# EAGLE design Main Board v1 (EAGLE 9.6.2)

## Sheet 1 of 2: High Power
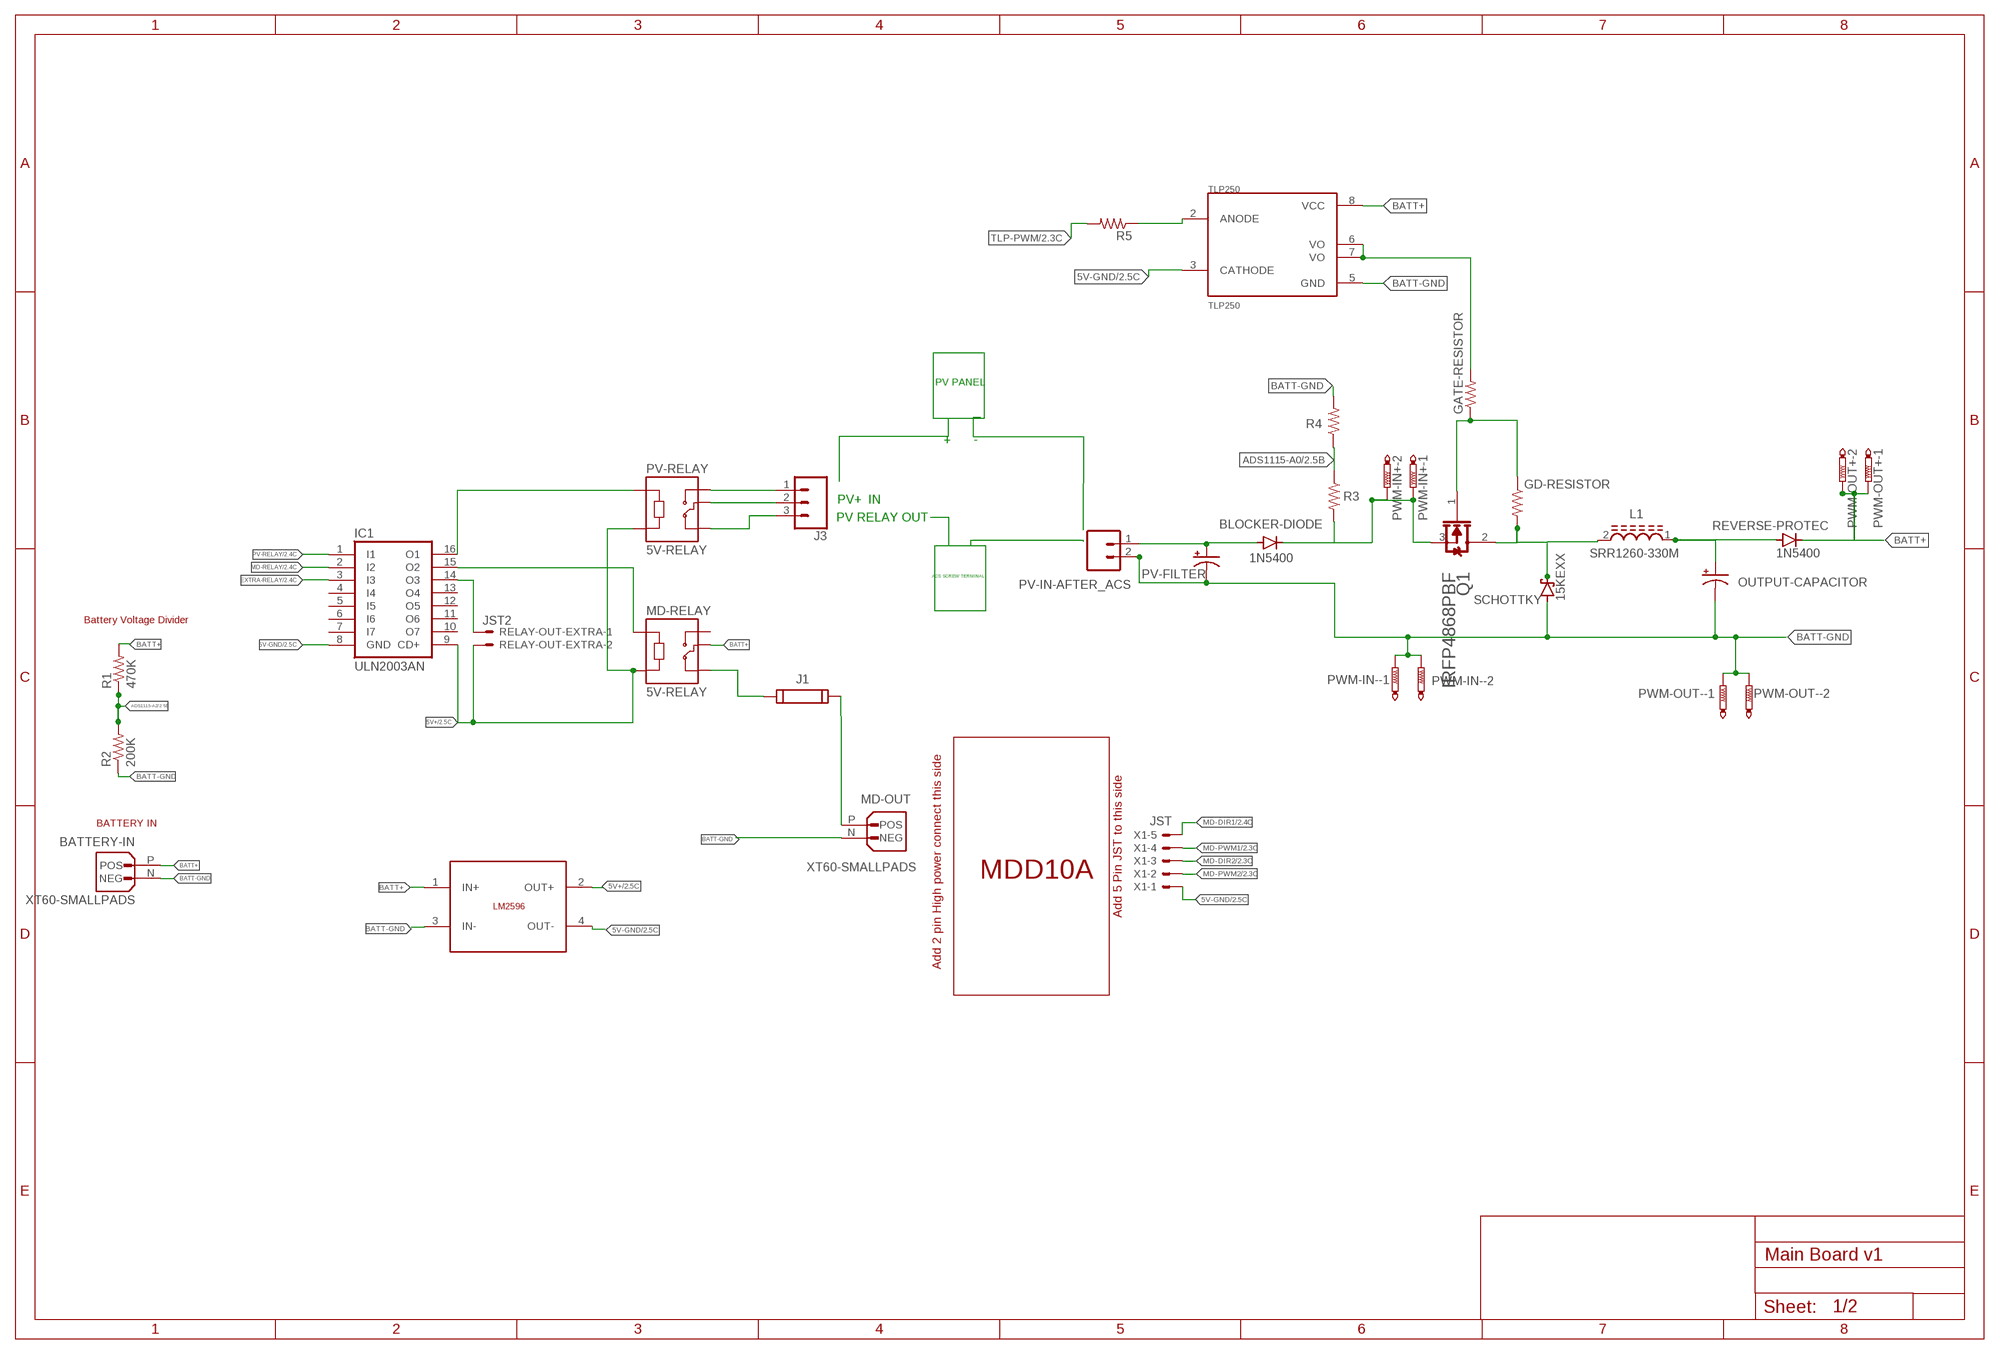
[diagram p0: schematic, sheet 1]

### Parts
BATTERY-IN  XT60-SMALLPADS  [XT-60-SMALLPADS]
BLOCKER-DIODE  1N5400  [DO201-15]
GATE-RESISTOR  R-US_0309/12  [0309/12]
GD-RESISTOR  R-US_0309/12  [0309/12]
IC1  ULN2003AN  [DIL16]
J1  696101000002  [696101000002]
J3  CONN_03SCREW_LOCK  [SCREWTERMINAL-3.5MM-3_LOCK.007S]
L1  SRR1260-330M  [INDP125125X600N]
MD-OUT  XT60-SMALLPADS  [XT-60-SMALLPADS]
MD-RELAY  5V-RELAY  [RELAY-SRD-05VDC-SL-C]
OUTPUT-CAPACITOR  1000UF-RADIAL-5MM-25V-20%-NO-SILK  [CPOL-RADIAL-5MM-10MM-NS]
PV-FILTER  1000UF-RADIAL-5MM-25V-20%-NO-SILK  [CPOL-RADIAL-5MM-10MM-NS]
PV-IN-AFTER_ACS  CONN_023.5MM  [SCREWTERMINAL-3.5MM-2]
PV-RELAY  5V-RELAY  [RELAY-SRD-05VDC-SL-C]
PWM-IN+  PTR2  [P2-38-17]
PWM-IN-  PTR2  [P2-38-17]
PWM-OUT+  PTR2  [P2-38-17]
PWM-OUT-  PTR2  [P2-38-17]
Q1  INFINEON_IRFP4868PBFINFINEON_IRFP4868PBF_0_0  [INFINEON_IRFP4868PBF_0]
R1  470K  R-US_0309/12  [0309/12]
R2  200K  R-US_0309/12  [0309/12]
R3  R-US_0309/12  [0309/12]
R4  R-US_0309/12  [0309/12]
R5  R-US_0309/12  [0309/12]
RELAY-OUT-EXTRA  JST2  JST-XH-02-PIN-LONG-PAD  [JST-XH-02-PACKAGE-LONG-PAD]
REVERSE-PROTEC  1N5400  [DO201-15]
SCHOTTKY  15KEXX  [CB429-17]
TLP250  TLP250  [DIP8]
U$2  MDD10A-MODULE  [MDD10A]
U$5  LM2596-MODULE  [LM2596-MODULE]
X1  JST  JST-XH-05-PIN-LONG-PAD  [JST-XH-05-PACKAGE-LONG-PAD]

### Nets
5V+: IC1.9(CD+) MD-RELAY.A2 PV-RELAY.A2 RELAY-OUT-EXTRA.2 U$5.2(OUT+) ; also sheet 2
5V-GND: IC1.8(GND) TLP250.3(CATHODE) U$5.4(OUT-) X1.1 ; also sheet 2
ADS1115-A0: R3.1 R4.1 ; also sheet 2
ADS1115-A2: R1.1 R2.2 ; also sheet 2
BATT+: BATTERY-IN.P(POS) MD-RELAY.COM PWM-OUT+.TP-1 PWM-OUT+.TP-2 R1.2 REVERSE-PROTEC.C TLP250.8(VCC) U$5.1(IN+)
BATT-GND: BATTERY-IN.N(NEG) MD-OUT.N(NEG) OUTPUT-CAPACITOR.- PV-FILTER.- PV-IN-AFTER_ACS.2 PWM-IN-.TP-1 PWM-IN-.TP-2 PWM-OUT-.TP-1 PWM-OUT-.TP-2 R2.1 R4.2 SCHOTTKY.A TLP250.5(GND) U$5.3(IN-)
EXTRA-RELAY: IC1.3(I3) ; also sheet 2
MD-DIR1: X1.5 ; also sheet 2
MD-DIR2: X1.3 ; also sheet 2
MD-PWM1: X1.4 ; also sheet 2
MD-PWM2: X1.2 ; also sheet 2
MD-RELAY: IC1.2(I2) ; also sheet 2
N$1: J1.2 MD-OUT.P(POS)
N$2: IC1.14(O3) RELAY-OUT-EXTRA.1
N$3: J3.1 PV-RELAY.NO
N$4: J3.2 PV-RELAY.COM
N$5: J1.1 MD-RELAY.NC
N$6: L1.1 OUTPUT-CAPACITOR.+ REVERSE-PROTEC.A
N$23: J3.3 PV-RELAY.NC
N$63: IC1.16(O1) PV-RELAY.A1
N$85: IC1.15(O2) MD-RELAY.A1
N$88: GD-RESISTOR.2 L1.2 Q1.2(D) SCHOTTKY.C
N$92: R5.1 TLP250.2(ANODE)
N$93: BLOCKER-DIODE.A PV-FILTER.+ PV-IN-AFTER_ACS.1
N$95: GATE-RESISTOR.2 TLP250.6(VO) TLP250.7(VO)
N$98: BLOCKER-DIODE.C PWM-IN+.TP-1 PWM-IN+.TP-2 Q1.3(S) R3.2
N$99: GATE-RESISTOR.1 GD-RESISTOR.1 Q1.1(G)
PV-RELAY: IC1.1(I1) ; also sheet 2
TLP-PWM: R5.2 ; also sheet 2
Unconnected: IC1.4(I4) IC1.5(I5) IC1.6(I6) IC1.7(I7) IC1.10(O7) IC1.11(O6) IC1.12(O5) IC1.13(O4) MD-RELAY.NO

### Notes on the sheet
- PV PANEL
- + | -
- PV+  IN
- PV RELAY OUT
- ACS SCREW TERMINAL
- Battery Voltage Divider
- BATTERY IN

## Sheet 2 of 2: Embedded System
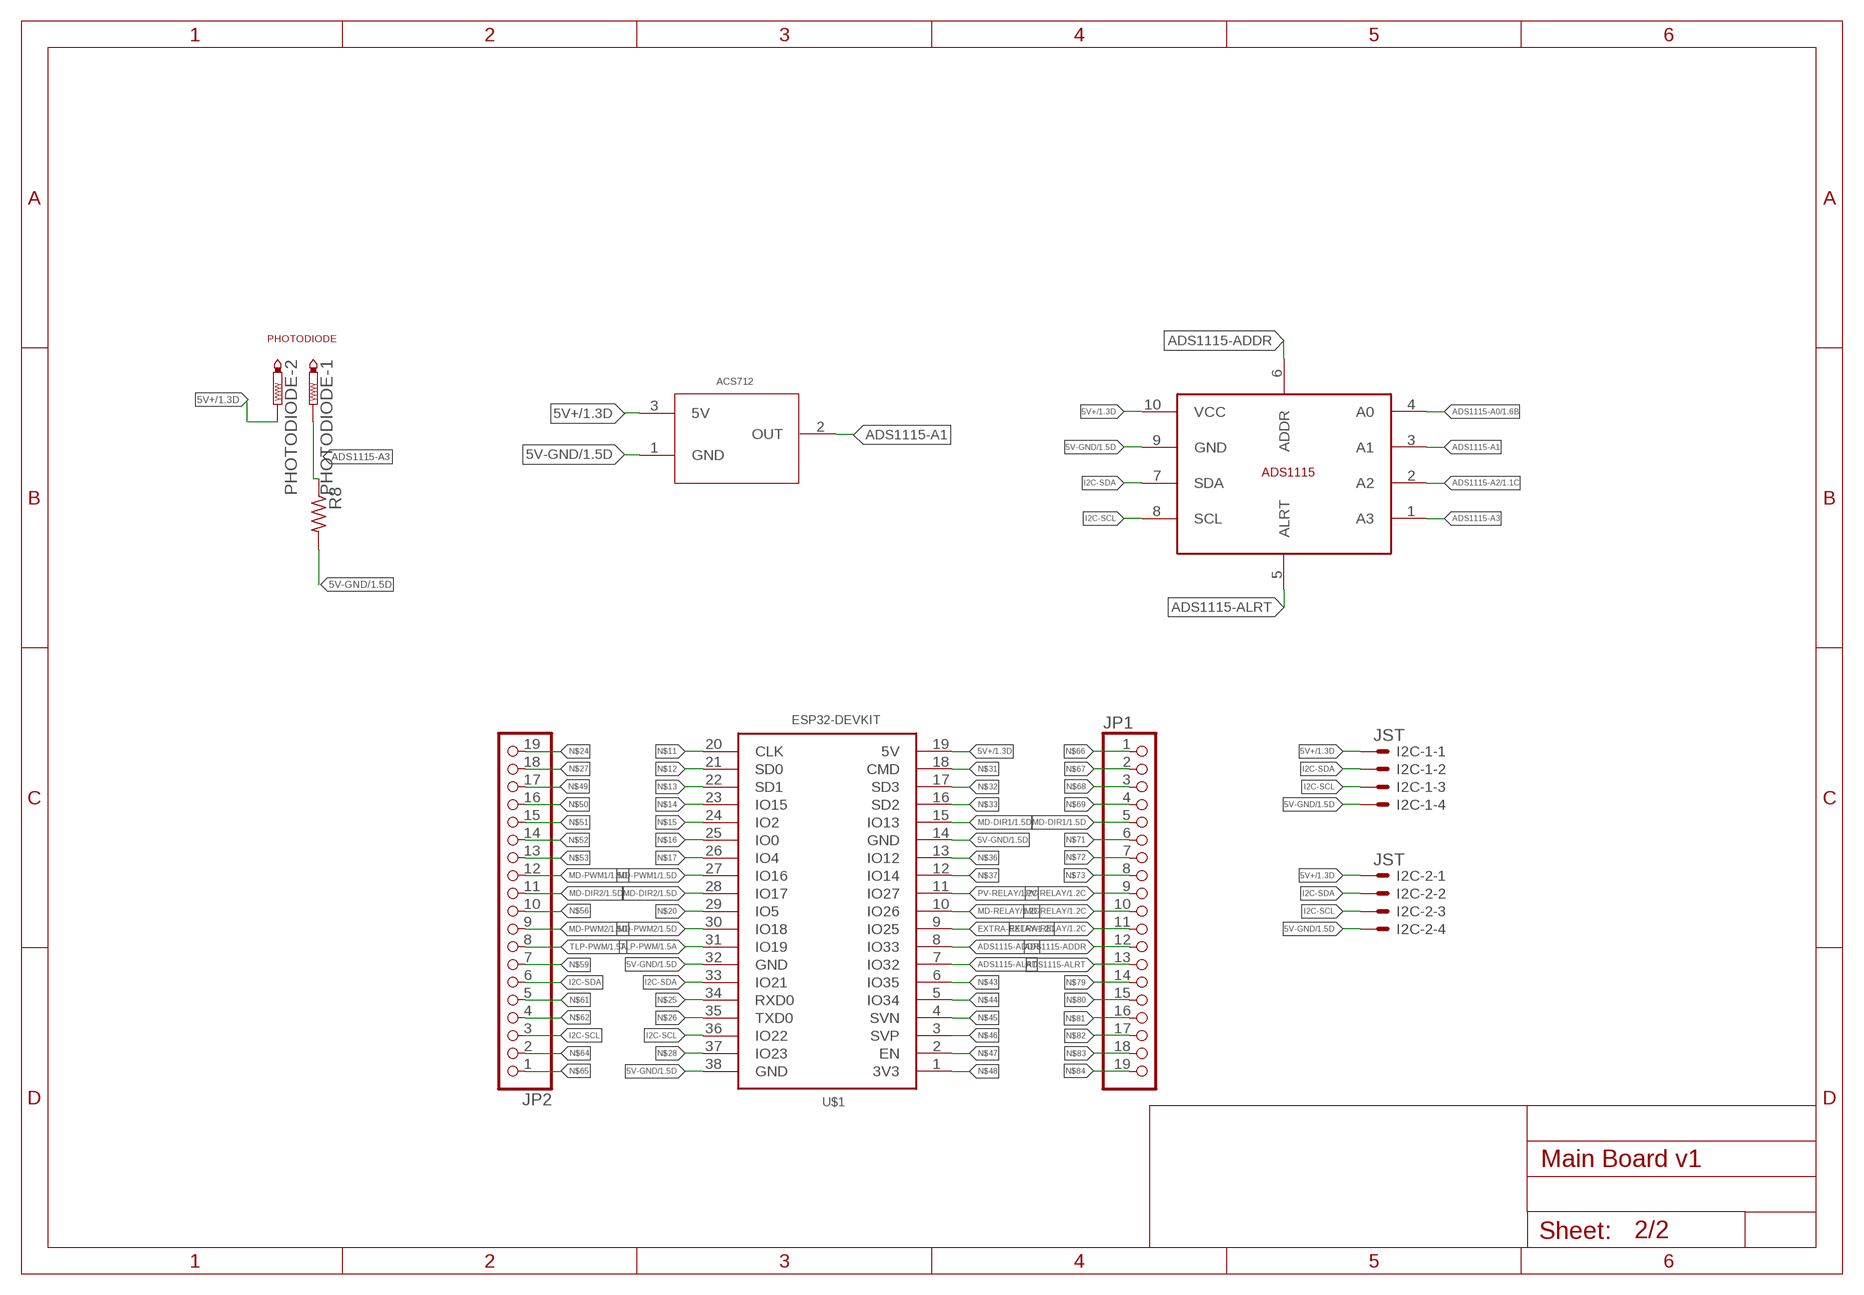
[diagram p1: schematic, sheet 2]

### Parts
I2C-1  JST  JST-XH-04-PIN-LONG-PAD  [JST-XH-04-PACKAGE-LONG-PAD]
I2C-2  JST  JST-XH-04-PIN-LONG-PAD  [JST-XH-04-PACKAGE-LONG-PAD]
JP1  PINHD-1X19  [1X19]
JP2  PINHD-1X19  [1X19]
PHOTODIODE  PTR2  [P2-38-17]
R8  R-US_0309/12  [0309/12]
U$1  ESP32-DEVKIT  [ESP32-38PINS]
U$3  ACS712-MODULE  [ACS712-MODULE]
U$4  ADS1115-MODULE  [ADS1115-MODULE]

### Nets
5V+: I2C-1.1 I2C-2.1 PHOTODIODE.TP-2 U$1.19(5V) U$3.3(5V) U$4.10(VCC) ; also sheet 1
5V-GND: I2C-1.4 I2C-2.4 R8.2 U$1.14(GND) U$1.32(GND) U$1.38(GND) U$3.1(GND) U$4.9(GND) ; also sheet 1
ADS1115-A0: U$4.4(A0) ; also sheet 1
ADS1115-A1: U$3.2(OUT) U$4.3(A1)
ADS1115-A2: U$4.2(A2) ; also sheet 1
ADS1115-A3: PHOTODIODE.TP-1 R8.1 U$4.1(A3)
ADS1115-ADDR: JP1.12 U$1.8(IO33) U$4.6(ADDR)
ADS1115-ALRT: JP1.13 U$1.7(IO32) U$4.5(ALRT)
EXTRA-RELAY: JP1.11 U$1.9(IO25) ; also sheet 1
I2C-SCL: I2C-1.3 I2C-2.3 JP2.3 U$1.36(IO22) U$4.8(SCL)
I2C-SDA: I2C-1.2 I2C-2.2 JP2.6 U$1.33(IO21) U$4.7(SDA)
MD-DIR1: JP1.5 U$1.15(IO13) ; also sheet 1
MD-DIR2: JP2.11 U$1.28(IO17) ; also sheet 1
MD-PWM1: JP2.12 U$1.27(IO16) ; also sheet 1
MD-PWM2: JP2.9 U$1.30(IO18) ; also sheet 1
MD-RELAY: JP1.10 U$1.10(IO26) ; also sheet 1
N$11: U$1.20(CLK)
N$12: U$1.21(SD0)
N$13: U$1.22(SD1)
N$14: U$1.23(IO15)
N$15: U$1.24(IO2)
N$16: U$1.25(IO0)
N$17: U$1.26(IO4)
N$20: U$1.29(IO5)
N$24: JP2.19
N$25: U$1.34(RXD0)
N$26: U$1.35(TXD0)
N$27: JP2.18
N$28: U$1.37(IO23)
N$31: U$1.18(CMD)
N$32: U$1.17(SD3)
N$33: U$1.16(SD2)
N$36: U$1.13(IO12)
N$37: U$1.12(IO14)
N$43: U$1.6(IO35)
N$44: U$1.5(IO34)
N$45: U$1.4(SVN)
N$46: U$1.3(SVP)
N$47: U$1.2(EN)
N$48: U$1.1(3V3)
N$49: JP2.17
N$50: JP2.16
N$51: JP2.15
N$52: JP2.14
N$53: JP2.13
N$56: JP2.10
N$59: JP2.7
N$61: JP2.5
N$62: JP2.4
N$64: JP2.2
N$65: JP2.1
N$66: JP1.1
N$67: JP1.2
N$68: JP1.3
N$69: JP1.4
N$71: JP1.6
N$72: JP1.7
N$73: JP1.8
N$79: JP1.14
N$80: JP1.15
N$81: JP1.16
N$82: JP1.17
N$83: JP1.18
N$84: JP1.19
PV-RELAY: JP1.9 U$1.11(IO27) ; also sheet 1
TLP-PWM: JP2.8 U$1.31(IO19) ; also sheet 1

### Notes on the sheet
- PHOTODIODE

## Library data of the parts
BATTERY-IN MD-OUT = XT60-M:XT60-SMALLPADS
BLOCKER-DIODE REVERSE-PROTEC = diode:1N5400: DIODE standard rectifier, 3 A, 50 V (Motorola)
GATE-RESISTOR GD-RESISTOR R1-R5 R8 = rcl:R-US_: RESISTOR, American symbol; SPICEPREFIX: R
I2C-1 I2C-2 = JST XH Connectors:JST-XH-04-PIN: JST XH Connector 2 Pin Wire to board connector. Pitch: 2,54 mm, (0.100") Number of pins: 4
IC1 = ULN2003A:ULN2003A: Darlington Array Check availability <https://pricing.snapeda.com/parts/ULN2003A/STMicroelectronics/view-part?ref=eda>; AVAILABILITY: In Stock; DESCRIPTION: DARLINGTON ARRAY 7NPN, 2003, DIP16; Transistor Polarity:NPN; Collector Emitter Voltage V(br)ceo:50V; DC Collector Current:500mA; DC Current Gain hFE:1000; Operating Temperature Range:-20°C to +85°C; Transistor Case Style:DIP; No. of Pins:16; SVHC:No SVHC (20-Jun-2011); Base Number:2003; Current Ic Continuous a Max:500mA; Device Marking:ULN2003A; IC Generic Number:2003; Input Type:TTL, CMOS 5V; Input Voltage Max:5V; Logic Function Number:2003; Module Configuration:Seven; No. of Channels:7; No. of Transistors:7; Operating Temperature Max:85°C; Operating Temperature Min:-20°C; Output Current Max:500mA; Output Type:Open Collector; Output Voltage Max:50V; Package / Case:DIP; Termination Type:Through Hole; Transistor Type:Power Darlington; MF: STMicroelectronics; MP: ULN2003A; PACKAGE: DIP-16 Sprague; PRICE: None; PURCHASE-URL: https://pricing.snapeda.com/search/part/ULN2003A/?ref=eda
J1 = Wurth_Connectors_WR-FSH:696101000002: WR-FSH Fuseholder THT Blocks PCB Clip Cover MATERIAL PROPERTIES Insulator Material PPO (PPE+PS) Insulator Flammability Rating UL94 V-1 Insulator Color Beige Contact Material Copper Alloy Contact Plating Tin over Nickel Contact Type Stamped GENERAL INFORMATION Operating Temperature -30 up to +120 °C Compliance RoHS ELECTRICAL PROPERTIES IR UL 18 A IR VDE 6.3 A Working Voltage [UL] 250 V (AC) Working Voltage [VDE] 250 V (AC) Withstanding Voltage [UL] 1500 V (AC) Withstanding Voltage [VDE] 1500 V (AC) Contact Resistance 10 mΩ MECHANICAL PROPERTIES Protection Class I & II Fuse Size 5x20 mm CERTIFICATION cULus Approval E157417 VDE Approval 129300 PACKAGING PROPERTIES Packaging Box <https://katalog.we-online.com/media/images/v2/o33101v209%20Family_WR-FSH_696101000002.jpg> Details see: https://katalog.we-online.com/en/em/FSH_THT_PCB_CLIP_COVER_696101000002 Updated by Ella Wu 2019-10-25 2019 (C) Wurth Elektronik; DATASHEET-URL: https://www.we-online.com/catalog/datasheet/696101000002.pdf; IR-UL: 18A; IR-VDE: 6.3A; MATES: 696120004001; PART-NUMBER: 696101000002; VALUE: 696101000002
J3 = SparkFun-Connectors:CONN_03: Multi connection point. Often used as Generic Header-pin footprint for 0.1 inch spaced/style header connections On any of the 0.1 inch spaced packages, you can populate with these: Break Away Headers - Straight <https://www.sparkfun.com/products/116> (PRT-00116) Break Away Male Headers - Right Angle <https://www.sparkfun.com/products/553> (PRT-00553) Female Headers <https://www.sparkfun.com/products/115> (PRT-00115) Break Away Headers - Machine Pin <https://www.sparkfun.com/products/117> (PRT-00117) Break Away Female Headers - Swiss Machine Pin <https://www.sparkfun.com/products/743> (PRT-00743) Stackable Header - 3 Pin (Female, 0.1") <https://www.sparkfun.com/products/13875> (PRT-13875) For SCREWTERMINALS and SPRING TERMINALS visit here: Screw Terimnals on SparkFun.com <https://www.sparkfun.com/search/results?term=Screw+Terminals> (5mm/3.5mm/2.54mm spacing) This device is also useful as a general connection point to wire up your design to another part of your project. Our various solder wires solder well into these plated through hole pads. Hook-Up Wire - Assortment (Stranded, 22 AWG) <https://www.sparkfun.com/products/11375> (PRT-11375) Hook-Up Wire - Assortment (Solid Core, 22 AWG) <https://www.sparkfun.com/products/11367> (PRT-11367) View the entire wire category on our website here <https://www.sparkfun.com/categories/141> Special notes: Molex polarized connector foot print use with SKU : PRT-08232 with associated crimp pins and housings.; PROD_ID: CONN-08288; SF_ID: PRT-08235
JP1 JP2 = pinhead:PINHD-1X19: PIN HEADER
L1 = SRR1260-330M Inductor:SRR1260-330M: Inductor Power Shielded Wirewound 33uH 20% 100KHz 27Q-Factor Ferrite 3A 60mOhm DCR T/R Check availability <https://pricing.snapeda.com/parts/SRR1260-330M/Bourns/view-part?ref=eda>; AVAILABILITY: In Stock; DESCRIPTION: 33 µH Shielded Drum Core, Wirewound Inductor 3 A 60mOhm Max Nonstandard; MF: Bourns; MP: SRR1260-330M; PACKAGE: Nonstandard Bourns; PRICE: None; PURCHASE-URL: https://pricing.snapeda.com/search/part/SRR1260-330M/?ref=eda
MD-RELAY PV-RELAY = 5V Relay:5V-RELAY: SRD-05VDC-SL-C 5V Trigger Relay Module For Arduino And Raspberry Pi 5V Trigger Relay Module For Arduino And Raspberry Pi Check availability <https://pricing.snapeda.com/parts/SRD-05VDC-SL-C/Songle%20Relay/view-part?ref=eda> Dimensions : 19.1x15.1x15.3 mm (LxWxH); AVAILABILITY: Not in stock; DESCRIPTION: 5V Trigger Relay Module For Arduino And Raspberry Pi 5V Trigger Relay Module For Arduino And Raspberry Pi; MF: Songle Relay; MP: SRD-05VDC-SL-C; PACKAGE: NON STANDARD-5 Songle Relay; PRICE: None
OUTPUT-CAPACITOR PV-FILTER = SparkFun-Capacitors:1000UF: 1,000µF/1mF ceramic capacitors A capacitor is a passive two-terminal electrical component used to store electrical energy temporarily in an electric field. CAP-08070
PHOTODIODE PWM-IN+ PWM-IN- PWM-OUT+ PWM-OUT- = testpad:PTR2: TEST PIN
PV-IN-AFTER_ACS = SparkFun-Connectors:CONN_02: Multi connection point. Often used as Generic Header-pin footprint for 0.1 inch spaced/style header connections On any of the 0.1 inch spaced packages, you can populate with these: Break Away Headers - Straight <https://www.sparkfun.com/products/116> (PRT-00116) Break Away Male Headers - Right Angle <https://www.sparkfun.com/products/553> (PRT-00553) Female Headers <https://www.sparkfun.com/products/115> (PRT-00115) Break Away Headers - Machine Pin <https://www.sparkfun.com/products/117> (PRT-00117) Break Away Female Headers - Swiss Machine Pin <https://www.sparkfun.com/products/743> (PRT-00743) For SCREWTERMINALS and SPRING TERMINALS visit here: Screw Terimnals on SparkFun.com <https://www.sparkfun.com/search/results?term=Screw+Terminals> (5mm/3.5mm/2.54mm spacing) This device is also useful as a general connection point to wire up your design to another part of your project. Our various solder wires solder well into these plated through hole pads. Hook-Up Wire - Assortment (Stranded, 22 AWG) <https://www.sparkfun.com/products/11375> (PRT-11375) Hook-Up Wire - Assortment (Solid Core, 22 AWG) <https://www.sparkfun.com/products/11367> (PRT-11367) View the entire wire category on our website here <https://www.sparkfun.com/categories/141> Special notes: Molex polarized connector foot print use with: PRT-08233 with associated crimp pins and housings. 2.54_SCREWTERM for use with PRT-10571. 3.5mm Screw Terminal footprints for PRT-08084 5mm Screw Terminal footprints for use with PRT-08432; PROD_ID: CONN-08399
Q1 = Infineon - IRFP4868PBF:INFINEON_IRFP4868PBF: Trans MOSFET N-CH 300V 70A 3-Pin(3+Tab) TO-247AC Tube; CENTROID_NOT_SPECIFIED: No; CONTINUOUS_DRAIN_CURRENT: 70A; DATASHEET: https://www.infineon.com/dgdl/Infineon-IRFP4868-DS-v01_02-EN.pdf?fileId=5546d462533600a40153562c9c822023; DEVICE_CLASS_L1: Discrete Semiconductors; DEVICE_CLASS_L2: Transistors; DEVICE_CLASS_L3: MOSFETs; DIGIKEY_DESCRIPTION: TRANS MOSFET N-CH 300V 70A TO-247AC; DIGIKEY_PART_NUMBER: IRFP4868PBF-ND; DRAIN_TO_SOURCE_BREAKDOWN_VOLTAGE: 300V; DRAIN_TO_SOURCE_RESISTANCE: 25.5mΩ; DRAIN_TO_SOURCE_VOLTAGE: 300V; FOOTPRINT_URL: https://www.infineon.com/dgdl/Infineon-PG-TO247-3-901-P-v01_00-EN.pdf?fileId=5546d46261ff5777016224bd45491aea; GATE_TO_SOURCE_VOLTAGE: 20V; HEIGHT: 24.99mm; INPUT_CAPACITACE_AT_VDS: 10774pF @ 50V; LEAD_FREE: yes; MAX_JUNCTION_TEMP: +175°C; MF: Infineon; MFG_PACKAGE_IDENT: PG-TO247-3; MFG_PACKAGE_IDENT_DATE: 0; MFG_PACKAGE_IDENT_REV: 901; MOUSER_PART_NUMBER: 942-IRFP4868PBF; MPN: IRFP4868PBF; NUMBER_OF_CHANNELS: 1; NUMBER_OF_N_CHANNELS: 1; PACKAGE: TO-247AC; POWER_DISSIPATION: 517W; PREFIX: Q; ROHS: yes; STANDOFF_HEIGHT: 3.71mm; TECHNOLOGY: MOSFET; TEMPERATURE_RANGE_HIGH: +175°C; TEMPERATURE_RANGE_LOW: -55°C; THRESHOLD_VGS: 3-5V; TURN_OFF_DELAY_TIME: 62ns; TURN_ON_DELAY_TIME: 24ns; VERIFICATION_VERSION: 0.0.0.1
RELAY-OUT-EXTRA = JST XH Connectors:JST-XH-02-PIN: JST XH Connector 2 Pin Wire to board connector. Pitch: 2,54 mm, (0.100") Number of pins: 2
SCHOTTKY = diode:15KEXX: DIODE
TLP250 = TLP250:TLP250: Optocoupler; THT; Out: IGBT driver; 2.5kV; DIP8; 1.5A Check availability <https://pricing.snapeda.com/parts/TLP250%28F%29/Toshiba/view-part?ref=eda>; AVAILABILITY: In Stock; DESCRIPTION: 1.5A Gate Driver Optical Coupling 2500Vrms 1 Channel 8-DIP; MF: Toshiba; MP: TLP250(F); PACKAGE: DIP-8 Toshiba; PRICE: None; PURCHASE-URL: https://pricing.snapeda.com/search/part/TLP250(F)/?ref=eda
U$1 = ESP32 Devkit:ESP32-DEVKIT: ESP32 Devkit 38 GPIO Pins Specifications: Single or Dual-Core 32-bit LX6 Microprocessor with clock frequency up to 240 MHz. 520 KB of SRAM, 448 KB of ROM and 16 KB of RTC SRAM. Supports 802.11 b/g/n Wi-Fi connectivity with speeds up to 150 Mbps. Support for both Classic Bluetooth v4.2 and BLE specifications. 34 Programmable GPIOs. Up to 18 channels of 12-bit SAR ADC and 2 channels of 8-bit DAC. Serial Connectivity include 4 x SPI, 2 x I2C, 2 x I2S, 3 x UART. Ethernet MAC for physical LAN Communication (requires external PHY). 1 Host controller for SD/SDIO/MMC and 1 Slave controller for SDIO/SPI. Motor PWM and up to 16-channels of LED PWM. Secure Boot and Flash Encryption. Cryptographic Hardware Acceleration for AES, Hash (SHA-2), RSA, ECC and RNG.
U$2 = MDD10A Module:MDD10A-MODULE: This device is to place a MDD10A module on the top/bottom of the PCB using standoff's. You are supposed to have JST/Equivalent connector to connect the MD to the PCB. Similarly you have to have a 2 large pads on the other side to power the MD.
U$3 = ACS712 Module:ACS712-MODULE
U$4 = ADS1115 MODULE:ADS1115-MODULE
U$5 = LM2596 Module:LM2596-MODULE
X1 = JST XH Connectors:JST-XH-05-PIN: JST XH Connector 2 Pin Wire to board connector. Pitch: 2,54 mm, (0.100") Number of pins: 5

## Board
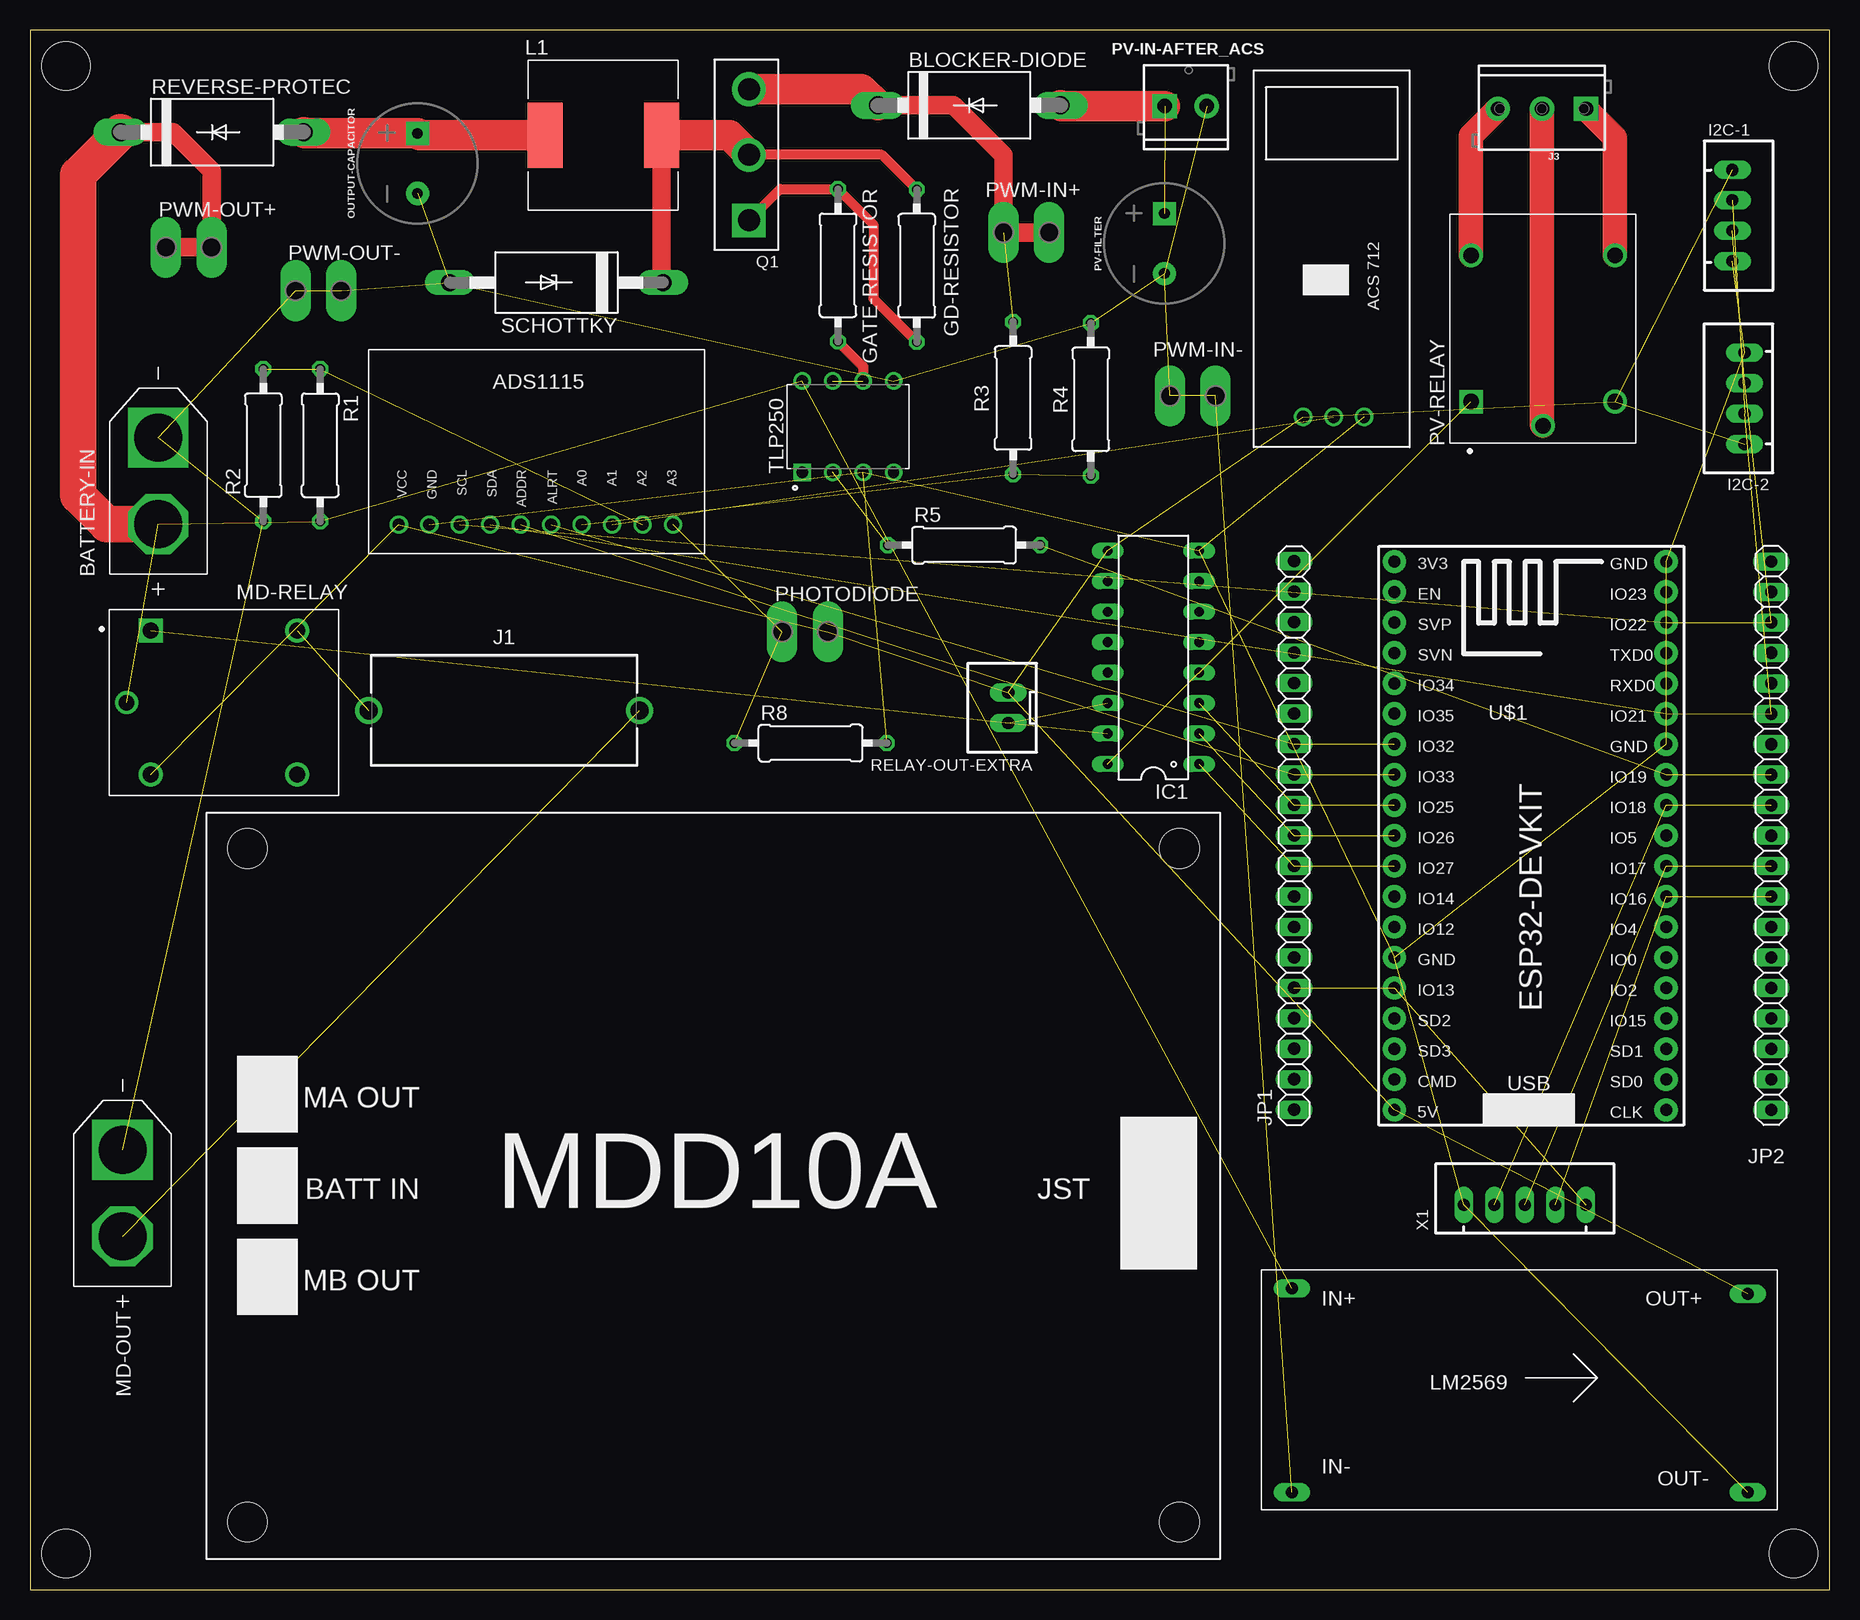
[diagram p2: board, top side]

Size 150 x 130 mm. Coordinates in mm from the lower left corner, seen from the top.
Outline: 0,0 150,0 150,130 0,130 0,0
Copper layers (1*16): Top 0.035mm / dielectric 1.5mm / Bottom 0.035mm
Design rules "default": minimum track width 6mil, minimum drill 0.35mm, track to track 6mil, track to pad 6mil, pad to pad 6mil, via to via 6mil, smd to smd 6mil, copper to edge 40mil, drill to drill 6mil, minimum pad ring 10mil, minimum via ring 8mil, stop-mask expansion 4mil, vias tented up to drill 0mil, thermal gap 10mil
Holes 4 mm at 147,127 3,127 3,3 147,3

### Footprints (pad centres in the part's own frame; a part is rotated, then mirrored left to right if it is on the bottom)
XT-60-SMALLPADS = drill 4 pad 5 square: N 3.6,0 | drill 4 pad 5 octagon: P -3.6,0
DO201-15 = drill 1.499 long: A 7.62,0; C -7.62,0
0309/12 = drill 0.813 octagon: 1 -6.35,0; 2 6.35,0
JST-XH-04-PACKAGE-LONG-PAD = drill 1.016 long: 1 -3.81,0; 2 -1.27,0; 3 1.27,0; 4 3.81,0
DIL16 = drill 0.813 long: 1 -8.89,-3.81; 2 -6.35,-3.81; 3 -3.81,-3.81; 4 -1.27,-3.81; 5 1.27,-3.81; 6 3.81,-3.81; 7 6.35,-3.81; 8 8.89,-3.81; 9 8.89,3.81; 10 6.35,3.81; 11 3.81,3.81; 12 1.27,3.81; 13 -1.27,3.81; 14 -3.81,3.81; 15 -6.35,3.81; 16 -8.89,3.81
696101000002 = drill 1.5: 1 -11.3,0; 2 11.3,0
SCREWTERMINAL-3.5MM-3_LOCK.007S = drill 1.2 pad 2.032 square: 1 -0.178,0 | drill 1.2 pad 2.032: 2 3.5,0; 3 7.178,0
1X19 = drill 1.016 long: 1 -22.86,0; 2 -20.32,0; 3 -17.78,0; 4 -15.24,0; 5 -12.7,0; 6 -10.16,0; 7 -7.62,0; 8 -5.08,0; 9 -2.54,0; 10 0,0; 11 2.54,0; 12 5.08,0; 13 7.62,0; 14 10.16,0; 15 12.7,0; 16 15.24,0; 17 17.78,0; 18 20.32,0; 19 22.86,0
INDP125125X600N = smd 2.9 x 5.4: 1 -4.85,0; 2 4.85,0
RELAY-SRD-05VDC-SL-C = drill 1.32 square: A1 -6.1,6 | drill 1.32: A2 -6.1,-6; NC 6.1,6; NO 6.1,-6 | drill 1.29: COM -8.1,0
CPOL-RADIAL-5MM-10MM-NS = drill 0.9 pad 1.93 square: + 2.5,0 | drill 0.9 pad 1.93: - -2.5,0
P2-38-17 = drill 1.702 pad 2.121 long: TP-1 -1.905,0; TP-2 1.905,0
SCREWTERMINAL-3.5MM-2 = drill 1.2 pad 2.032 square: 1 0,0 | drill 1.2 pad 2.032: 2 3.5,0
INFINEON_IRFP4868PBF_0 = drill 1.85 pad 2.8 square: 1 -0.227,5.46 | drill 1.85 pad 2.8: 2 -0.227,0; 3 -0.227,-5.46
JST-XH-02-PACKAGE-LONG-PAD = drill 1.016 long: 1 -1.27,0; 2 1.27,0
CB429-17 = drill 1.397 long: A 8.89,0; C -8.89,0
DIP8 = drill 0.93 square: 1 0.97,9.14 | drill 0.93: 2 0.97,6.6; 3 0.97,4.06; 4 0.97,1.52; 5 8.59,1.52; 6 8.59,4.06; 7 8.59,6.6; 8 8.59,9.14
ESP32-38PINS = drill 1 pad 1.93: 1 1.408,47.131; 2 1.408,44.591; 3 1.408,42.051; 4 1.408,39.511; 5 1.408,36.971; 6 1.408,34.431; 7 1.408,31.891; 8 1.408,29.351; 9 1.408,26.811; 10 1.408,24.271; 11 1.408,21.731; 12 1.408,19.191; 13 1.408,16.651; 14 1.408,14.111; 15 1.408,11.571; 16 1.408,9.031; 17 1.408,6.491; 18 1.408,3.951; 19 1.408,1.411; 20 24.058,1.411; 21 24.058,3.951; 22 24.058,6.491; 23 24.058,9.031; 24 24.058,11.571; 25 24.058,14.111; 26 24.058,16.651; 27 24.058,19.191; 28 24.058,21.731; 29 24.058,24.271; 30 24.058,26.811; 31 24.058,29.351; 32 24.058,31.891; 33 24.058,34.431; 34 24.058,36.971; 35 24.058,39.511; 36 24.058,42.051; 37 24.058,44.591; 38 24.058,47.131
MDD10A = hole 3.3: 81.09,3.06; 3.42,3.06; 3.42,59.22; 81.09,59.22
ACS712-MODULE = drill 1.016: 1 2.54,3.81; 2 2.54,6.35; 3 2.54,8.89
ADS1115-MODULE = drill 1.016: 1 2.43,2.62; 2 2.43,5.16; 3 2.43,7.7; 4 2.43,10.24; 5 2.43,12.78; 6 2.43,15.32; 7 2.43,17.86; 8 2.43,20.4; 9 2.43,22.94; 10 2.43,25.48
LM2596-MODULE = drill 1.016 long: 1 2.54,18.46; 2 40.54,18; 3 2.54,1.46; 4 40.54,1.46
JST-XH-05-PACKAGE-LONG-PAD = drill 1.016 long: 1 -5.08,0; 2 -2.54,0; 3 0,0; 4 2.54,0; 5 5.08,0

### Placement (x,y rotation side)
BATTERY-IN  10.7,92.41 90 top
BLOCKER-DIODE  78.29,123.72 0 top
GATE-RESISTOR  67.35,110.39 270 top
GD-RESISTOR  73.92,110.35 90 top
I2C-1  141.91,114.53 270 top
I2C-2  142.92,99.3 90 top
IC1  93.64,77.7 90 top
J1  39.52,73.28 0 top
J3  129.53,123.44 180 top
JP1  105.37,62.86 90 top
JP2  145.14,62.84 270 top
L1  47.79,121.22 0 top
MD-OUT  7.71,33.04 90 top
MD-RELAY  16.16,73.93 0 top
OUTPUT-CAPACITOR  32.3,118.88 90 top
PHOTODIODE  64.6,79.83 0 top
PV-FILTER  94.55,112.2 90 top
PV-IN-AFTER_ACS  94.59,123.65 0 top
PV-RELAY  126.12,105.11 90 top
PWM-IN+  83.05,113.12 0 top
PWM-IN-  96.92,99.51 0 top
PWM-OUT+  13.23,111.88 0 top
PWM-OUT-  24.03,108.27 0 top
Q1  59.7,119.6 180 top
R1  24.19,95.39 270 top
R2  19.45,95.39 90 top
R3  81.95,99.32 90 top
R4  88.42,99.21 90 top
R5  77.86,87.06 0 top
R8  65.07,70.56 0 top
RELAY-OUT-EXTRA  81.54,73.51 90 top
REVERSE-PROTEC  15.18,121.48 0 top
SCHOTTKY  43.88,108.94 180 top
TLP250  73.51,92.16 90 top
U$1  112.32,38.57 0 top
U$2  14.71,2.56 0 top
U$3  115.01,95.21 90 top
U$4  56.22,86.34 90 top
U$5  102.64,6.65 0 top
X1  124.61,32.07 0 top

### Tracks (layer width: path | path; a pad name or v marks a point on that pad's centre or on a via)
5V+  (10 unrouted)
5V-GND  (11 unrouted)
ADS1115-A0  (2 unrouted)
ADS1115-A1  (1 unrouted)
ADS1115-A2  (2 unrouted)
ADS1115-A3  (2 unrouted)
ADS1115-ADDR  (2 unrouted)
ADS1115-ALRT  (2 unrouted)
BATT+  (4 unrouted)
  Top 1.524: REVERSE-PROTEC.C 11.92,121.48 15.13,118.27 PWM-OUT+.TP-2 PWM-OUT+.TP-1
  Top 3.048: REVERSE-PROTEC.C 4,117.92 4,91.2 6.39,88.81 BATTERY-IN.P
BATT-GND  (13 unrouted)
EXTRA-RELAY  (2 unrouted)
I2C-SCL  (4 unrouted)
I2C-SDA  (4 unrouted)
MD-DIR1  (2 unrouted)
MD-DIR2  (2 unrouted)
MD-PWM1  (2 unrouted)
MD-PWM2  (2 unrouted)
MD-RELAY  (2 unrouted)
N$1  (1 unrouted)
N$2  (1 unrouted)
N$3
  Top 2.032: J3.1 132.12,121.03 PV-RELAY.NO
N$4
  Top 2.032: J3.2 126.03,97.1 PV-RELAY.COM
N$5  (1 unrouted)
N$6
  Top 2.54: L1.1 32.46,121.22 OUTPUT-CAPACITOR.+ 22.9,121.38 REVERSE-PROTEC.A
N$23
  Top 2.032: J3.3 120.12,121.21 PV-RELAY.NC
N$63  (1 unrouted)
N$85  (1 unrouted)
N$88
  Top 0.813: GD-RESISTOR.2 71.02,119.6 Q1.2
  Top 1.524: L1.2 52.64,109.07 SCHOTTKY.C
  Top 2.54: L1.2 58.31,121.22 Q1.2
N$92  (1 unrouted)
N$93  (1 unrouted)
  Top 2.54: PV-IN-AFTER_ACS.1 85.98,123.65 BLOCKER-DIODE.A
N$95  (1 unrouted)
  Top 0.813: GATE-RESISTOR.2 69.45,101.94 TLP250.6
N$98  (1 unrouted)
  Top 1.524: BLOCKER-DIODE.C 76.98,123.72 81.14,119.56 PWM-IN+.TP-1 PWM-IN+.TP-2
  Top 2.54: BLOCKER-DIODE.C 69.33,125.06 Q1.3
N$99
  Top 0.813: Q1.1 62.53,116.74 GATE-RESISTOR.1 70.3,113.79 70.3,107.62 GD-RESISTOR.1
PV-RELAY  (2 unrouted)
TLP-PWM  (2 unrouted)